# EAGLE design EPM7064S (EAGLE 7.2.0)
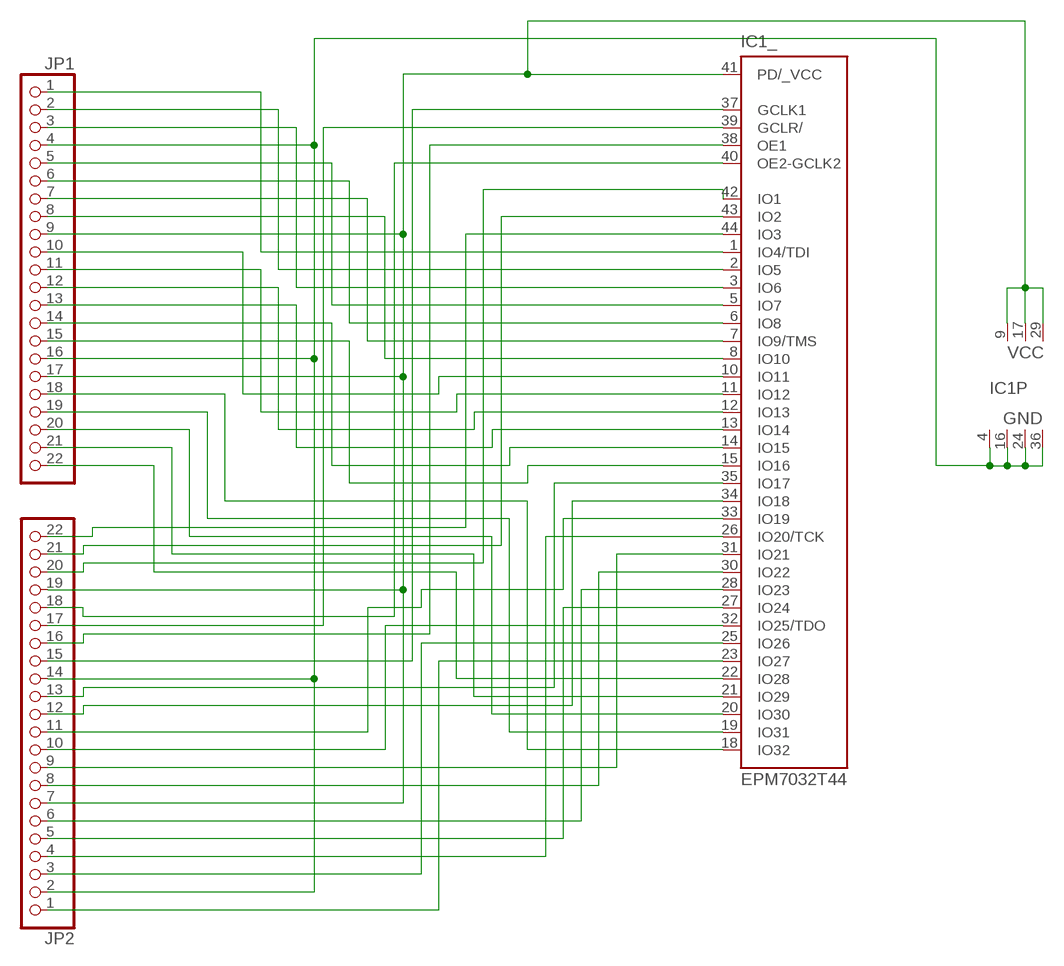
[diagram p0: schematic, sheet 1]

## Parts
IC1  EPM7032T44  [TQFP44]
JP1  PINHD-1X22  [1X22]
JP2  PINHD-1X22  [1X22]

## Nets
N$1: IC1.1(_:IO4/TDI) JP1.1
N$2: IC1.2(_:IO5) JP1.2
N$3: IC1.3(_:IO6) JP1.3
N$4: IC1.4(P:GND) IC1.16(P:GND) IC1.24(P:GND) IC1.36(P:GND) JP1.4 JP1.16 JP2.2 JP2.14
N$5: IC1.9(P:VCC) IC1.17(P:VCC) IC1.29(P:VCC) IC1.41(_:PD/_VCC) JP1.9 JP1.17 JP2.7 JP2.19
N$6: IC1.5(_:IO7) JP1.5
N$7: IC1.6(_:IO8) JP1.6
N$8: IC1.7(_:IO9/TMS) JP1.7
N$9: IC1.8(_:IO10) JP1.8
N$10: IC1.10(_:IO11) JP1.10
N$11: IC1.11(_:IO12) JP1.11
N$12: IC1.12(_:IO13) JP1.12
N$13: IC1.13(_:IO14) JP1.13
N$14: IC1.14(_:IO15) JP1.14
N$15: IC1.15(_:IO16) JP1.15
N$16: IC1.18(_:IO32) JP1.18
N$17: IC1.19(_:IO31) JP1.19
N$18: IC1.20(_:IO30) JP1.20
N$19: IC1.21(_:IO29) JP1.21
N$20: IC1.22(_:IO28) JP1.22
N$21: IC1.23(_:IO27) JP2.1
N$22: IC1.25(_:IO26) JP2.3
N$23: IC1.26(_:IO20/TCK) JP2.4
N$24: IC1.27(_:IO24) JP2.5
N$25: IC1.28(_:IO23) JP2.6
N$26: IC1.30(_:IO22) JP2.8
N$27: IC1.31(_:IO21) JP2.9
N$28: IC1.32(_:IO25/TDO) JP2.10
N$29: IC1.33(_:IO19) JP2.11
N$30: IC1.34(_:IO18) JP2.12
N$31: IC1.35(_:IO17) JP2.13
N$32: IC1.37(_:GCLK1) JP2.15
N$33: IC1.38(_:OE1) JP2.16
N$34: IC1.39(_:GCLR/) JP2.17
N$35: IC1.40(_:OE2-GCLK2) JP2.18
N$36: IC1.42(_:IO1) JP2.20
N$37: IC1.43(_:IO2) JP2.21
N$38: IC1.44(_:IO3) JP2.22

## Library data of the parts
IC1 = altera:EPM7032: EPM7032 MAX 7000 family; MPN: EPM7032SLC44-6N; OC_FARNELL: 1549447; OC_NEWARK: 51R9532
JP1 JP2 = pinhead:PINHD-1X22: PIN HEADER

## Board
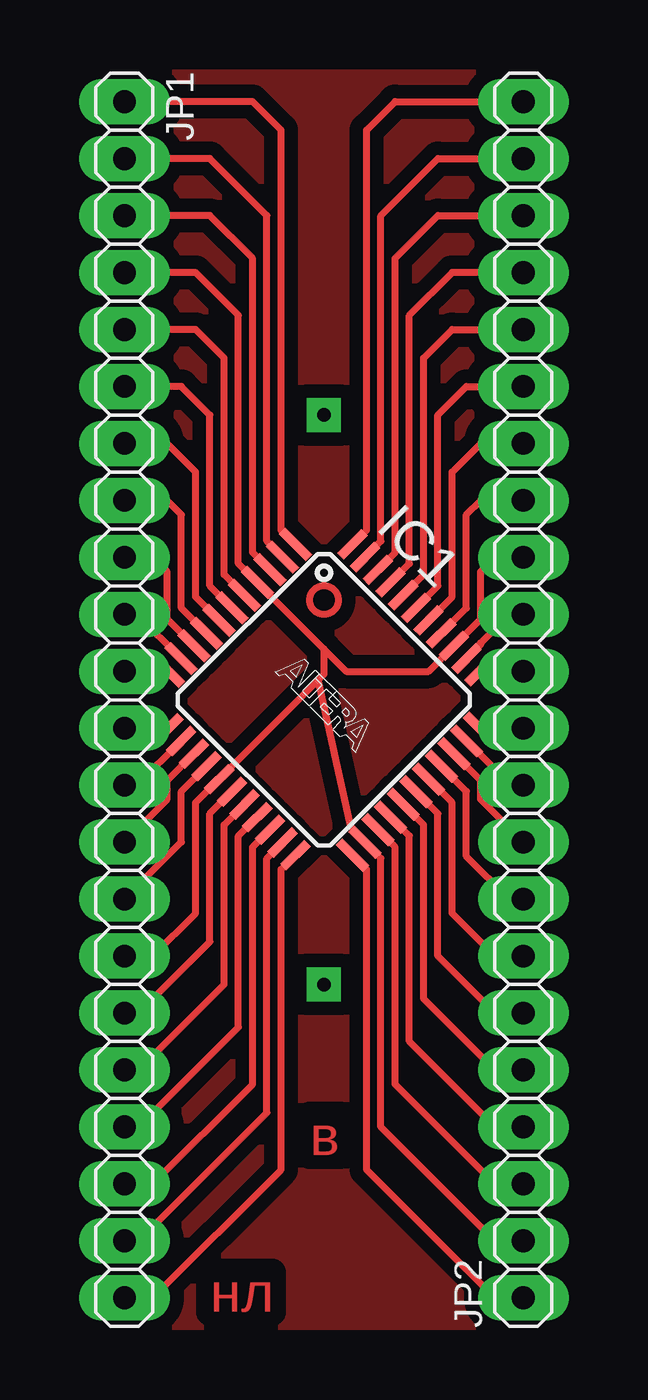
[diagram p1: board, top side]
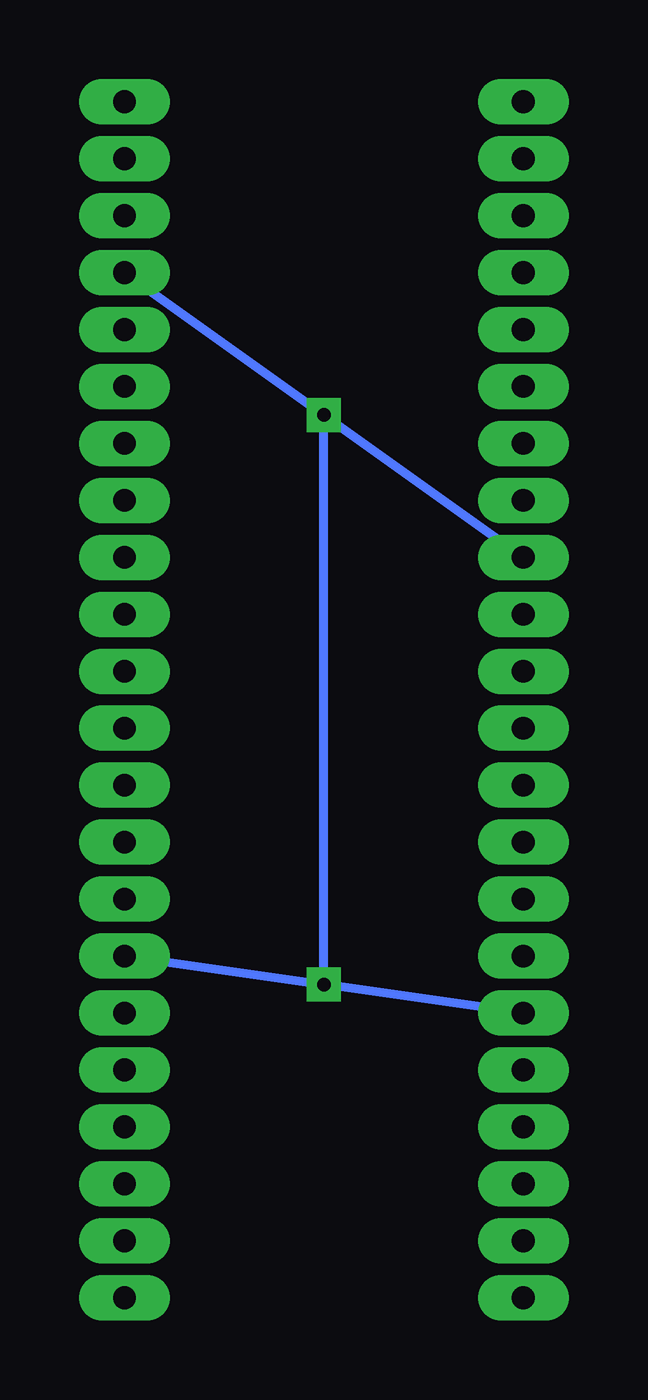
[diagram p2: board, bottom side, seen from below]

No outline drawn. Coordinates in mm, seen from the top.
Copper layers (1*16): Top 0.035mm / dielectric 1.5mm / Bottom 0.035mm
Design rules "default *": minimum track width 10mil, minimum drill 24mil, track to track 8mil, track to pad 8mil, pad to pad 8mil, via to via 8mil, smd to smd 8mil, copper to edge 40mil, drill to drill 8mil, minimum pad ring 20mil, minimum via ring 18mil, stop-mask expansion 4mil, vias tented up to drill 0mil, thermal gap 10mil

### Footprints (pad centres in the part's own frame; a part is rotated, then mirrored left to right if it is on the bottom)
TQFP44 = smd 1.702 x 0.406: 1 -5.8,4; 2 -5.8,3.2; 3 -5.8,2.4; 4 -5.8,1.6; 5 -5.8,0.8; 6 -5.8,0; 7 -5.8,-0.8; 8 -5.8,-1.6; 9 -5.8,-2.4; 10 -5.8,-3.2; 11 -5.8,-4; 23 5.8,-4; 24 5.8,-3.2; 25 5.8,-2.4; 26 5.8,-1.6; 27 5.8,-0.8; 28 5.8,0; 29 5.8,0.8; 30 5.8,1.6; 31 5.8,2.4; 32 5.8,3.2; 33 5.8,4 | smd 0.406 x 1.524: 12 -4,-5.8; 13 -3.2,-5.8; 14 -2.4,-5.8; 15 -1.6,-5.8; 16 -0.8,-5.8; 17 0,-5.8; 18 0.8,-5.8; 19 1.6,-5.8; 20 2.4,-5.8; 21 3.2,-5.8; 22 4,-5.8; 34 4,5.8; 35 3.2,5.8; 36 2.4,5.8; 37 1.6,5.8; 38 0.8,5.8; 39 0,5.8; 40 -0.8,5.8; 41 -1.6,5.8; 42 -2.4,5.8; 43 -3.2,5.8; 44 -4,5.8
1X22 = drill 1.016 long: 1 -26.67,0; 2 -24.13,0; 3 -21.59,0; 4 -19.05,0; 5 -16.51,0; 6 -13.97,0; 7 -11.43,0; 8 -8.89,0; 9 -6.35,0; 10 -3.81,0; 11 -1.27,0; 12 1.27,0; 13 3.81,0; 14 6.35,0; 15 8.89,0; 16 11.43,0; 17 13.97,0; 18 16.51,0; 19 19.05,0; 20 21.59,0; 21 24.13,0; 22 26.67,0

### Placement (x,y rotation side)
IC1  8.89,30.48 315 top
JP1  0,30.48 270 top
JP2  17.78,30.48 90 top

### Tracks (layer width: path | path; a pad name or v marks a point on that pad's centre or on a via)
N$1
  Top 0.305: JP1.1 5.71,57.15 6.99,55.88 6.99,38.04 IC1.1
N$2
  Top 0.305: JP1.2 3.81,54.61 6.35,52.07 6.35,37.55 IC1.2
N$3
  Top 0.305: JP1.3 3.81,52.07 5.71,50.16 5.71,37.05 IC1.3
N$4
  Top 0.305: JP2.14 16.51,36.83 15.88,36.2 15.88,34.07 IC1.36 13.55,31.75 9.88,31.75 8.89,32.74 | JP1.4 3.17,49.53 5.08,47.62 5.08,36.55 IC1.4 8.89,32.74 | JP1.16 1.27,19.05 3.17,20.95 3.17,25.9 IC1.16 8.64,31.36 | JP2.2 16.51,6.35 11.43,11.43 11.43,23.41 IC1.24 10.09,24.83 8.64,31.36 | 8.89,32.74 8.89,31.61 8.64,31.36
N$5  (via drill 0.6)
  Top 0.305: IC1.9 1.91,34.07 1.91,36.2 1.27,36.83 JP1.9 | IC1.17 3.81,25.4 3.81,19.68 0.64,16.51 JP1.17 | IC1.29 14.61,25.9 14.61,20.95 16.51,19.05 JP2.7 | JP2.19 14.61,49.53 12.7,47.62 12.7,36.55 IC1.41
  Bottom 0.406: JP1.9 v8.89,43.18 | v8.89,43.18 JP2.19 | JP1.17 v8.89,17.78 | v8.89,17.78 v8.89,43.18 | JP2.7 v8.89,17.78
N$6
  Top 0.305: JP1.5 3.17,46.99 4.45,45.72 4.45,36.06 IC1.5
N$7
  Top 0.305: JP1.6 2.54,44.45 3.81,43.18 3.81,35.56 IC1.6
N$8
  Top 0.305: JP1.7 1.91,41.91 3.17,40.64 3.17,35.06 IC1.7
N$9
  Top 0.305: JP1.8 1.91,39.37 2.54,38.73 2.54,34.57 IC1.8
N$10
  Top 0.305: JP1.10 0.56,34.29 IC1.10
N$11
  Top 0.305: JP1.11 IC1.11
N$12
  Top 0.305: JP1.12 IC1.12
N$13
  Top 0.305: JP1.13 0.56,26.67 IC1.13
N$14
  Top 0.305: JP1.14 1.91,26.04 1.91,26.89 IC1.14
N$15
  Top 0.305: JP1.15 2.54,24.13 2.54,26.39 IC1.15
N$16
  Top 0.305: JP1.18 0.64,13.97 4.45,17.78 4.45,24.9 IC1.18
N$17
  Top 0.305: JP1.19 0.64,11.43 5.08,15.88 5.08,24.41 IC1.19
N$18
  Top 0.305: JP1.20 1.27,8.89 5.71,13.34 5.71,23.91 IC1.20
N$19
  Top 0.305: JP1.21 0.64,6.35 6.35,12.06 6.35,23.41 IC1.21
N$20
  Top 0.305: JP1.22 1.27,3.81 6.99,9.53 6.99,22.92 IC1.22
N$21
  Top 0.305: JP2.1 16.51,3.81 10.79,9.53 10.79,22.92 IC1.23
N$22
  Top 0.305: JP2.3 16.51,8.89 12.06,13.34 12.06,23.91 IC1.25
N$23
  Top 0.305: JP2.4 16.51,11.43 12.7,15.24 12.7,24.41 IC1.26
N$24
  Top 0.305: JP2.5 16.51,13.97 13.34,17.14 13.34,24.9 IC1.27
N$25
  Top 0.305: JP2.6 16.51,16.51 13.97,19.05 13.97,25.4 IC1.28
N$26
  Top 0.305: JP2.8 17.14,21.59 15.24,23.5 15.24,26.39 IC1.30
N$27
  Top 0.305: JP2.9 15.88,26.04 15.88,26.89 IC1.31
N$28
  Top 0.305: JP2.10 17.23,26.67 IC1.32
N$29
  Top 0.305: JP2.11 IC1.33
N$30
  Top 0.305: JP2.12 IC1.34
N$31
  Top 0.305: 15.88,33.02 17.14,34.29 JP2.13 | 15.25,32.4 15.88,33.02 | 15.88,33.02 15.88,32.94 IC1.35
N$32
  Top 0.305: JP2.15 15.88,39.37 15.24,38.73 15.24,34.57 IC1.37
N$33
  Top 0.305: JP2.16 15.88,41.91 14.61,40.64 14.61,35.06 IC1.38
N$34
  Top 0.305: JP2.17 15.24,44.45 13.97,43.18 13.97,35.56 IC1.39
N$35
  Top 0.305: JP2.18 14.61,46.99 13.34,45.72 13.34,36.06 IC1.40
N$36
  Top 0.305: JP2.20 13.97,52.07 12.06,50.16 12.06,37.05 IC1.42
N$37
  Top 0.305: JP2.21 13.97,54.61 11.43,52.07 11.43,37.55 IC1.43
N$38
  Top 0.305: JP2.22 12.06,57.15 10.79,55.88 10.79,38.04 IC1.44
N$39
  pour Top (isolate 0.61): -1.27,2.54 19.05,2.54 19.05,58.42 -1.27,58.42
(copper drawn outside any net)
  shapes: Top circle x1

### Text on the board
Top: в | нл